# Altium project OpAmpSD.PRJPCB
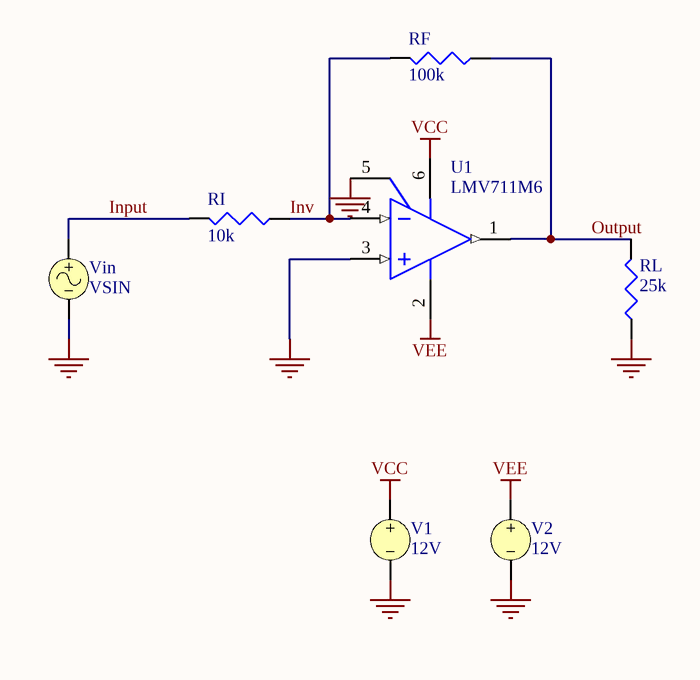
[diagram p0: OpAmpSD.schdoc]
1 sheet, 7 parts. Net scope: global (net labels, ports and power ports of the same name join across sheets).

## Sheet OpAmpSD.schdoc: Analog Amplifier
size A4; Organization: Altium Limited; Address1: L3, 12a Rodborough Rd; Address2: Frenchs Forest; Address3: NSW; Address4: Australia 2086; DocumentNumber: 1; SheetNumber: 1; SheetTotal: 1

### Parts
RF  100k
RI  10k
RL  25k
U1  LMV711M6  [MF06A_N]
V1  12V
V2  value 12V  (hidden comment: -12V)
Vin  VSIN

### Nets
GND: RL.2(BOT) U1.3(IN+) U1.5(SHDN) V1.2 V2.2 Vin.2
VCC: U1.6(V+) V1.1
VEE: U1.2(V-) V2.1
Input: RI.1(TOP) Vin.1
Inv: RF.1(TOP) RI.2(BOT) U1.4(IN-)
Output: RF.2(BOT) RL.1(TOP) U1.1(OUT)

### Notes on the sheet
- Title
- Size:
- Date:
- A4
- Number:
- Time:
- Revision:
- Sheet
- of
- File:

### Library data of the parts
RF RI RL = RES: Resistor
  RF: Value: 100k
  RI: Value: 10k
  RL: Value: 25k
U1 = LMV711M6: Low Power, RRIO Operational Amplifiers with High Output Current Drive and Shutdown Option; Manufacturer: National Semiconductor; PackageTopMarking: A47A*XTT; Published: 4-Dec-2008; DatasheetVersion: Jun-2005; PackageVersion: revC, Sep-2005; PackageReference: MF06A; Publisher: Altium Limited; PackageDescription: Molded SOT-23, .115 x .063 x .040in Body, 6 Lead, .0375in in Pitch; CompType: Amplifiers; PartNumber: LMV711M6; RoHS: O; PinCount: 6; DigiKeyPartNumber: LMV711M6CT-ND; Code_JEDEC: MO-178-AB; Code_IPC: SOT26A-6; ComponentLink1Description: LMV711 Datasheet; ComponentLink1URL: http://www.national.com/ds/LM/LMV711.pdf; ComponentLink2Description: LMV711 Web Page; ComponentLink2URL: http://www.national.com/pf/LM/LMV711.html; ComponentLink3Description: MF06A Package Page; ComponentLink3URL: http://www.national.com/packaging/folders/mf06a.html; DeviceFunction: Amplifier
V1 V2 = VSRC: Voltage Source
  V1: Value: 12V
Vin = VSIN: Sinusoidal Voltage Source